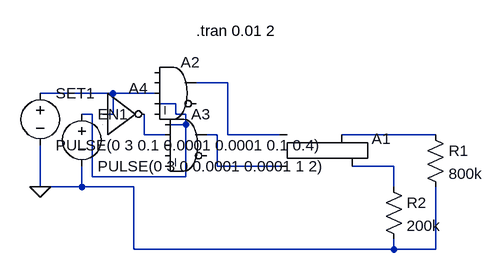
[diagram p0: schematic Dlatch.asc]
Dlatch.asc, the LTspice schematic file:
Version 4
SHEET 1 880 680
WIRE 400 192 352 192
WIRE 224 208 112 208
WIRE 288 208 224 208
WIRE 320 224 288 224
WIRE 192 240 176 240
WIRE 224 240 224 208
WIRE 224 240 208 240
WIRE 320 240 320 224
WIRE 336 240 320 240
WIRE 336 256 336 240
WIRE 336 256 304 256
WIRE 272 272 272 240
WIRE 304 272 272 272
WIRE 384 272 368 272
WIRE 400 272 400 192
WIRE 480 272 400 272
WIRE 720 272 576 272
WIRE 384 320 384 272
WIRE 480 320 384 320
WIRE 656 320 592 320
WIRE 192 336 192 240
WIRE 336 336 336 256
WIRE 336 336 192 336
WIRE 112 352 112 288
WIRE 176 352 176 320
WIRE 176 352 112 352
WIRE 256 352 176 352
WIRE 656 352 656 320
WIRE 256 448 256 352
WIRE 656 448 656 432
WIRE 656 448 256 448
WIRE 720 448 720 352
WIRE 720 448 656 448
FLAG 112 352 0
SYMBOL Digital/srflop 528 224 R0
SYMATTR InstName A1
SYMBOL voltage 112 192 R0
SYMATTR InstName SET1
SYMATTR Value PULSE(0 3 0.1 0.0001 0.0001 0.1 0.4)
SYMBOL res 704 256 R0
SYMATTR InstName R1
SYMATTR Value 800k
SYMBOL res 640 336 R0
SYMATTR InstName R2
SYMATTR Value 200k
SYMBOL Digital/and 320 144 R0
SYMATTR InstName A2
SYMBOL Digital/and 336 224 R0
SYMATTR InstName A3
SYMBOL voltage 176 224 R0
SYMATTR InstName EN1
SYMATTR Value PULSE(0 3 0 0.0001 0.0001 1 2)
SYMBOL Digital/inv 208 176 R0
SYMATTR InstName A4
TEXT 352 112 Left 2 !.tran 0.01 2

The netlist it stands for:
* Dlatch.asc
A1 N001 N005 0 0 0 N007 N006 0 SRFLOP
V§SET1 N002 0 PULSE(0 3 0.1 0.0001 0.0001 0.1 0.4)
R1 N006 0 800k
R2 N007 0 200k
A2 0 0 N002 N003 0 0 N001 0 AND
A3 N003 N004 0 0 0 0 N005 0 AND
V§EN1 N003 0 PULSE(0 3 0 0.0001 0.0001 1 2)
A4 N002 0 0 0 0 N004 0 0 BUF
.tran 0.01 2
.backanno
.end